# Altium schematic sheet Main.SchDoc
size A4
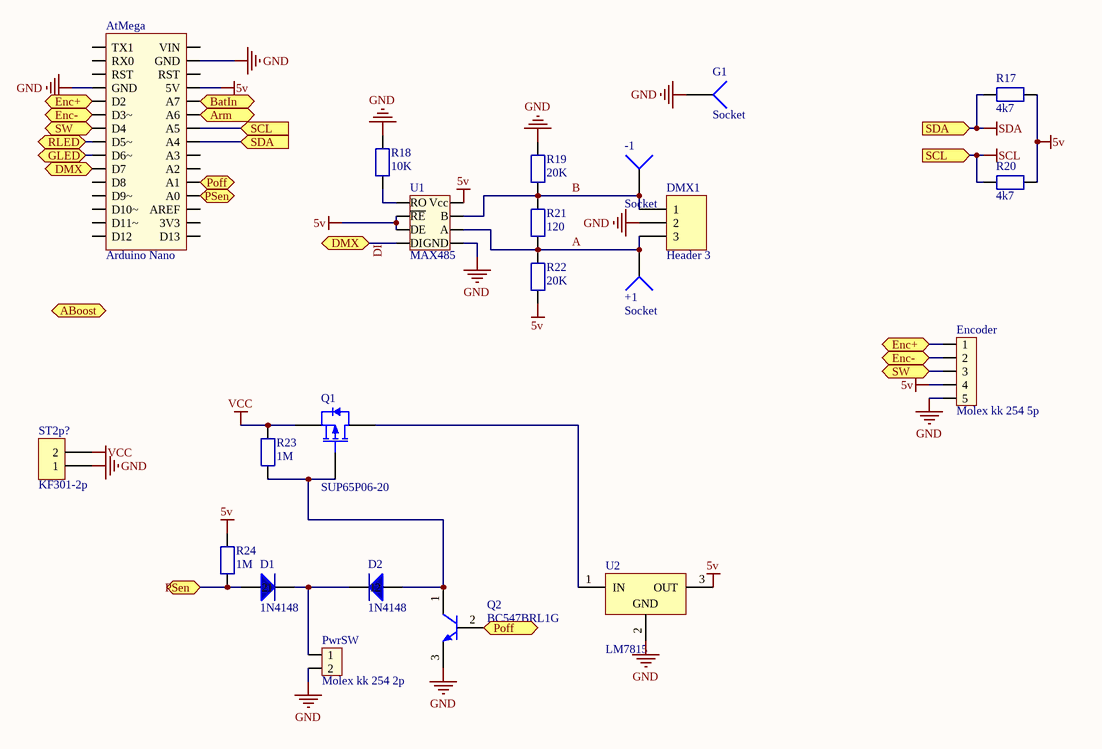
[diagram p0: Main.SchDoc]

## Parts
+1  Socket  [PIN1]
-1  Socket  [PIN1]
AtMega  Arduino Nano  [Arduino Nano]
D1  1N4148  [1N4148-AX0.2"]
D2  1N4148  [1N4148-AX0.2"]
DMX1  Header 3  [HDR1X3]
Encoder  Molex kk 254 5p  [Molex kk 254 5p]
G1  Socket  [PIN1]
PwrSW  Molex kk 254 2p  [Molex kk 254 2p]
Q1  SUP65P06-20  [TO-220AB]
Q2  BC547BRL1G  [ONSC-TO-92-3-29-11_AM_BL]
R17  4k7  [Axial 0.3" 1/4W]
R18  10K  [Axial 0.3" 1/4W]
R19  20K  [Axial 0.3" 1/4W]
R20  4k7  [Axial 0.3" 1/4W]
R21  120  [Axial 0.3" 1/4W]
R22  20K  [Axial 0.3" 1/4W]
R23  1M  [Axial 0.3" 1/4W]
R24  1M  [Axial 0.3" 1/4W]
ST2p?  KF301-2p  [KF301-2p_0.2"]
U1  MAX485  [DIP8]
U2  LM7815  [221A-04]

## Ports
ABoost, Arm, BatIn, DMX, Enc+, Enc-, GLED, Poff, PSen, RLED, SCL, SDA, SW

## Nets
5v: AtMega.27(5V) Encoder.4 R17.2 R20.2 R22.1 R24.2 U1.2(~{RE}) U1.3(DE) U1.8(Vcc) U2.3(OUT)
GND: AtMega.4(GND) AtMega.29(GND) DMX1.2 Encoder.5 G1.1 PwrSW.2 Q2.3(E) R18.1 R19.2 ST2p?.1 U1.5(GND) U2.2(GND)
SCL: AtMega.24(A5) R20.1 ; port SCL
SDA: AtMega.23(A4) R17.1 ; port SDA
VCC: Q1.3(S) R23.2 ST2p?.2
A: +1.1 DMX1.3 R21.1 R22.2 U1.6(A)
Arm: AtMega.25(A6) ; port Arm
B: -1.1 DMX1.1 R19.1 R21.2 U1.7(B)
BatIn: AtMega.26(A7) ; port BatIn
DI: AtMega.10(D7) U1.4(DI) ; port DMX
Enc+: AtMega.5(D2) Encoder.1 ; port Enc+
Enc-: AtMega.6(D3~) Encoder.2 ; port Enc-
GLED: AtMega.9(D6~) ; port GLED
Poff: AtMega.20(A1) Q2.2(B) ; port Poff
PSen: AtMega.19(A0) D1.1 R24.1 ; port PSen
RLED: AtMega.8(D5~) ; port RLED
SW: AtMega.7(D4) Encoder.3 ; port SW
NetD1_2: D1.2 D2.2 PwrSW.1
NetD2_1: D2.1 Q1.1(G) Q2.1(C) R23.1
NetQ1_2: Q1.2(D) U2.1(IN)
NetR18_2: R18.2 U1.1(RO)

Not connected (* = marked no-connect by the designer): AtMega 1(TX1) 2(RX0) 3(RST) 11(D8) 12(D9~) 13(D10~) 14(D11~) 15(D12) 16(D13) 17(3V3) 18(AREF) 21(A2) 22(A3) 28(RST) 30(VIN)

## Library data of the parts
DMX1 = Header 3: Header, 3-Pin; LatestRevisionDate: 17-Jul-2002; LatestRevisionNote: Re-released for DXP Platform.; Publisher: Altium Limited
Q1 = SUP65P06-20: P-Channel 60V (D-S), 175'C  MOSFET; Note: Pin 2 (Drain) is connected to TAB; Published: 8-Jun-2000; LatestRevisionDate: 17-Jul-2002; LatestRevisionNote: Re-released for DXP Platform.; DatasheetVersion: 24-Feb-1998; PackageReference: TO-220AB; Publisher: Altium Limited; PackageDescription: TO, Thru-Hole, Vertical, Heatsink Mounted; 3 In-Line Leads; Pitch 2.54 mm; Code_JEDEC: TO-220-AB-alt; ComponentLink1Description: Manufacturer Link; ComponentLink1URL: http://www.vishay.com/; ComponentLink2Description: Datasheet; ComponentLink2URL: http://www.vishay.com/docs/70289/70289.pdf
Q2 = BC547BRL1G: Amplifier Transistor, NPN Silicon, 3-Pin TO-92, Pb-Free, Tape and Reel; Manufacturer: On Semiconductor; fT Min (MHz): 150; IC Continuous (A): 0.1; DatasheetVersion: Rev. 7; PackageVersion: Rev. AM; PackageReference: TO-92-3-29-11_AM_BL; PackageDescription: 3-Pin Transistor Outline, Body 4.825 x 3.685 mm, Pitch 1.27 mm; Supplier 1: Digi-Key; Supplier Part Number 1: BC547BRL1GOSTR-ND; Supplier 2: Digi-Key; Supplier Part Number 2: BC547BRL1GOSCT-ND; Supplier 3: Farnell; Supplier Part Number 3: 2317853; Supplier 4: Farnell; Supplier Part Number 4: 2317547; Supplier 5: Newark; Supplier Part Number 5: 26K3431; Supplier 6: Mouser; Supplier Part Number 6: 863-BC547BRL1G; Packing: Tape and Reel; Polarity: NPN; RoHS: TRUE; Mounting Technology: Through Hole; PartNumber: BC547BRL1G; ComponentLink1Description: Manufacturer URL; ComponentLink1URL: http://www.onsemi.com/; ComponentLink2Description: Datasheet; ComponentLink2URL: http://www.onsemi.com/pub_link/Collateral/BC546-D.PDF; ComponentLink3Description: Package Specification; ComponentLink3URL: http://www.onsemi.com/pub_link/Collateral/MAC97-D.PDF
R17-R24 = Axial 0.3" 1/4W
ST2p? = KF301-2p_0.2": Screw terminal KF301-2p 0.2" pitch 5.08mm
U1 = MAX845 DIP8
U2 = LM7815: 3-Terminal Positive Fixed Voltage Regulator; Note: Heatsink surface connected to pin 2.; Published: 17-Jul-2002; DatasheetVersion: 1988; PackageReference: 221A-04; Publisher: Altium Limited; PackageDescription: TO, Thru-Hole, Vertical, Heatsink Mounted; 3 In-Line Leads; Pitch 2.54 mm; Code_JEDEC: TO-262-AA; ComponentLink1Description: Manufacturer Link; ComponentLink1URL: http://www.onsemi.com/site/products/taxonomy/0,4438,503,00.html
+1 -1 G1 = Socket: LatestRevisionDate: 17-Jul-2002; LatestRevisionNote: Re-released for DXP Platform.; Publisher: Altium Limited